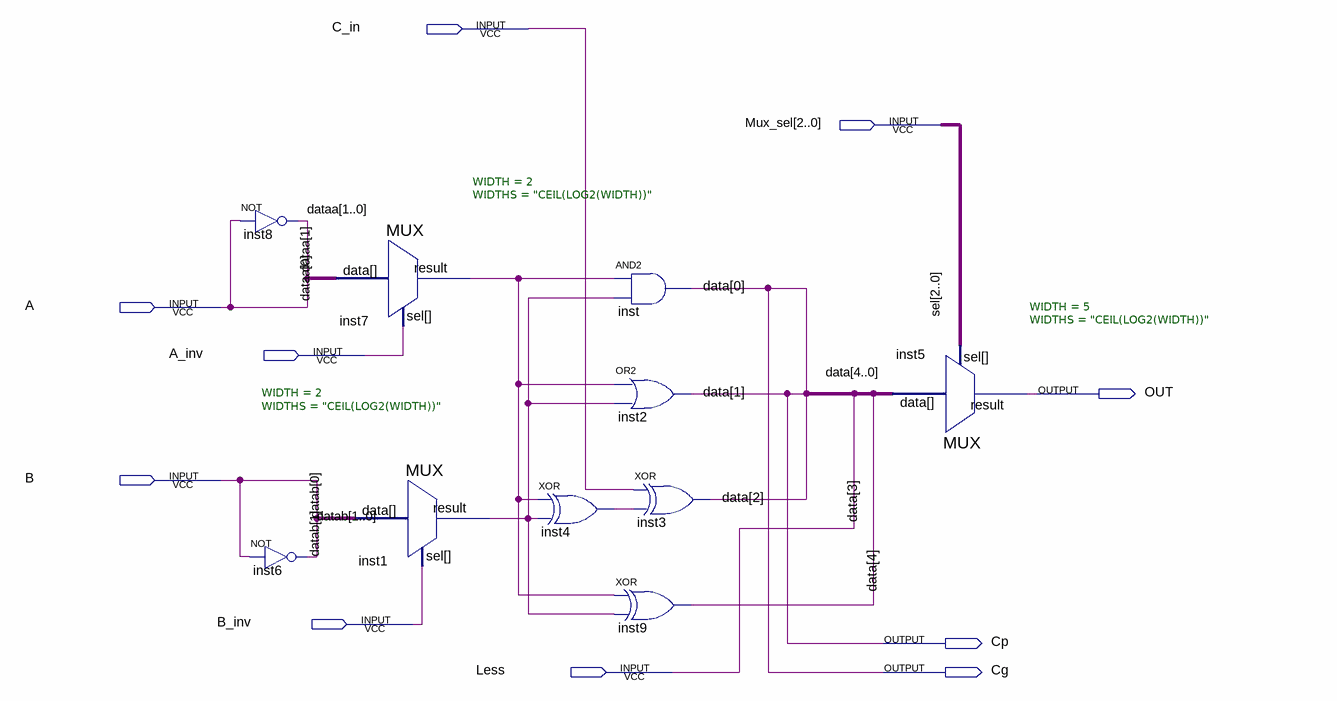
[diagram p0: schematic sheet]
// Quartus schematic Ula1bit.bdf as structural Verilog: 10 symbols, 10 pins
module Ula1bit (
  input  C_in,
  input  [2:0] Mux_sel,
  input  A,
  input  A_inv,
  input  B,
  input  B_inv,
  input  Less,
  output OUT,
  output Cp,
  output Cg
);

  wire inst1_result, inst4_out, inst7_result;
  wire [1:1] dataa, datab;
  wire [4:2] data;

  not inst8 (dataa[1], A);
  not inst6 (datab[1], B);
  MUX #(.WIDTH(2), .WIDTHS("CEIL(LOG2(WIDTH))")) inst7 (.data({dataa[1], A}), .sel(A_inv), .result(inst7_result));
  MUX #(.WIDTH(2), .WIDTHS("CEIL(LOG2(WIDTH))")) inst1 (.data({datab[1], B}), .sel(B_inv), .result(inst1_result));
  xor inst4 (inst4_out, inst7_result, inst1_result);
  and inst (Cg, inst7_result, inst1_result);
  or inst2 (Cp, inst7_result, inst1_result);
  xor inst3 (data[2], C_in, inst4_out);
  xor inst9 (data[4], inst7_result, inst1_result);
  MUX #(.WIDTH(5), .WIDTHS("CEIL(LOG2(WIDTH))")) inst5 (
    .data({data[4], Less, data[2], Cp, Cg}), .sel(Mux_sel), .result(OUT));

  // Other names for the same wires on the sheet: dataa[0] = A; datab[0] = B; data (some bits) = {Less, Cp, Cg};
  //   sel[2:0] = Mux_sel
endmodule
